# Altium schematic sheet schema.SchDoc
size A3
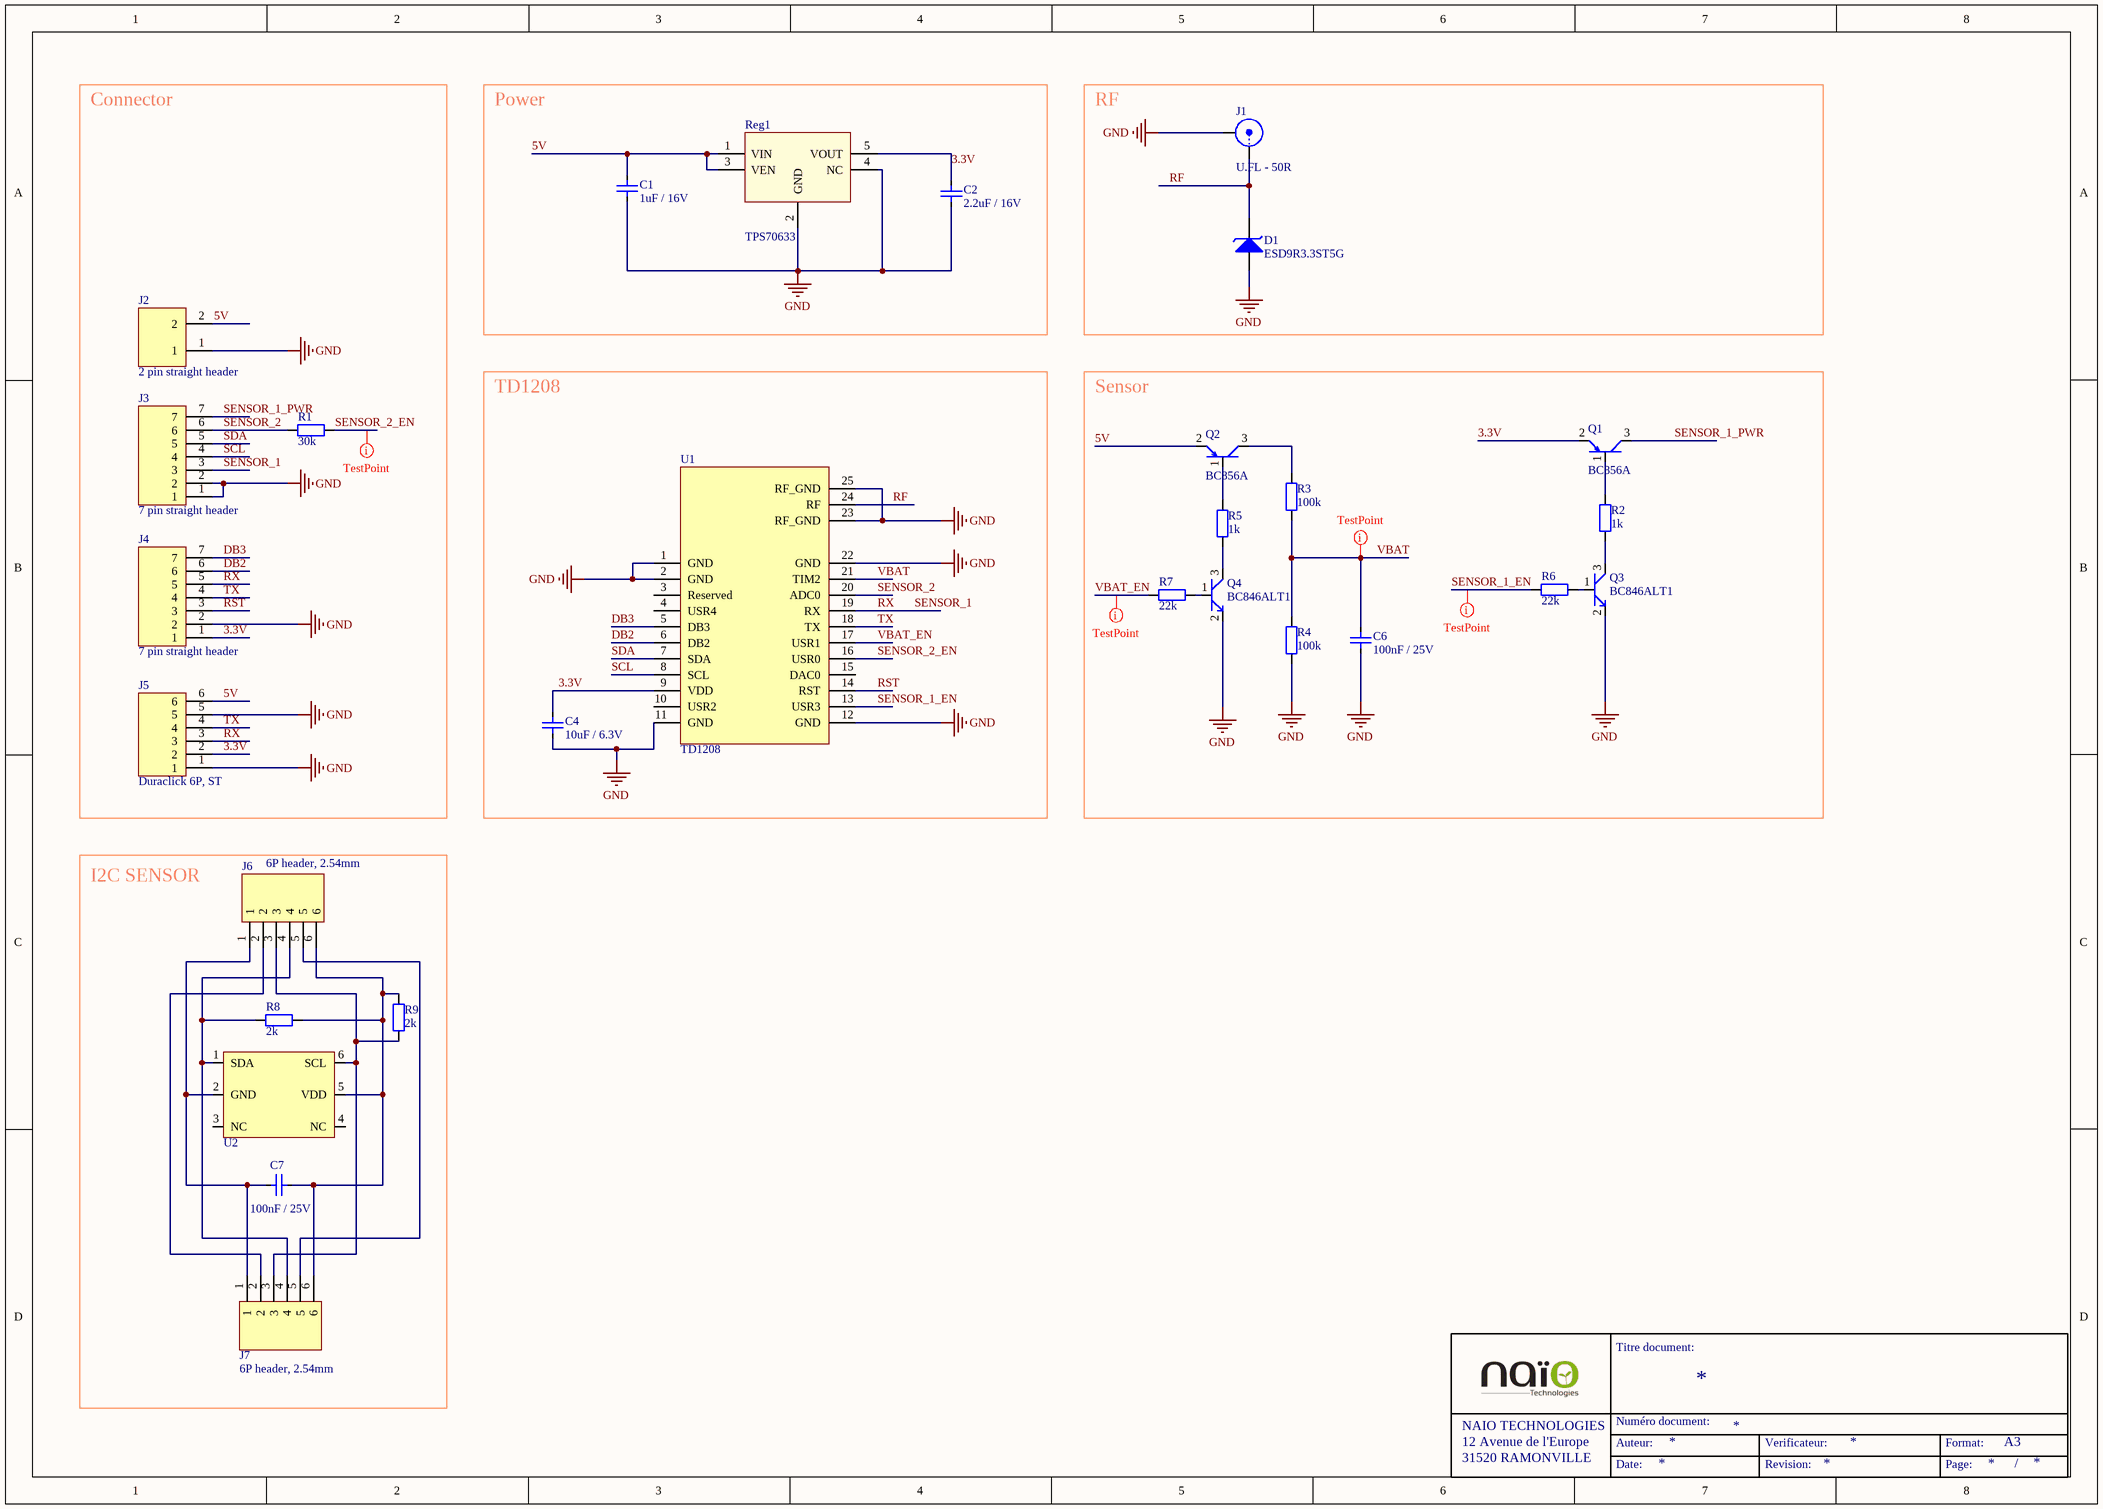
[diagram p0: schema.SchDoc]

## Parts
C1  Displayed reference: 1uF / 16V  [C0805-STD]  (hidden comment: CAP-SMD)
C2  Displayed reference: 2.2uF / 16V  [C0805-STD]  (hidden comment: CAP-SMD)
C4  Displayed reference: 10uF / 6.3V  [C0805-STD]  (hidden comment: CAP-SMD)
C6  Displayed reference: 100nF / 25V  [C0603-STD]  (hidden comment: CAP-SMD)
C7  Displayed reference: 100nF / 25V  [C0603-STD]  (hidden comment: CAP-SMD)
D1  Displayed reference: ESD9R3.3ST5G  [SOD923-SPE-ESD9R33ST5G]  (hidden comment: ESD9R33ST5G-SOD923)
J1  Displayed reference: U.FL - 50R  [UFL_R_SMT1-STD]  (hidden comment: COAX-RF)
J2  Displayed reference: 2 pin straight header  [CONN-STD-2_254_STRAIGHT_HEADER]  (hidden comment: CONN-STD-2P_1ROW)
J3  Displayed reference: 7 pin straight header  [CONN-STD-7_254_STRAIGHT_HEADER]  (hidden comment: CONN-STD-7P_1ROW)
J4  Displayed reference: 7 pin straight header  [CONN-STD-7_254_STRAIGHT_HEADER]  (hidden comment: CONN-STD-7P_1ROW)
J5  Displayed reference: Duraclick 6P, ST  [CONN-SPE-560020-0620_MOLEX]  (hidden comment: CONN-STD-6P_1ROW)
J6  Displayed reference: 6P header, 2.54mm  [6P_HEADER-STD_TH_1ROW]  (hidden comment: CONN-STD-6P_1ROW)
J7  Displayed reference: 6P header, 2.54mm  [6P_HEADER-STD_TH_1ROW]  (hidden comment: CONN-STD-6P_1ROW)
Q1  Displayed reference: BC856A  [SOT23-STD]  (hidden comment: BC856A-SOT23)
Q2  Displayed reference: BC856A  [SOT23-STD]  (hidden comment: BC856A-SOT23)
Q3  Displayed reference: BC846ALT1  [SOT23-STD]  (hidden comment: BC846ALT1-SOT23)
Q4  Displayed reference: BC846ALT1  [SOT23-STD]  (hidden comment: BC846ALT1-SOT23)
R1  Displayed reference: 30k  [R0805-STD]  (hidden comment: RES-SMD)
R2  Displayed reference: 1k  [R0603-STD]  (hidden comment: RES-SMD)
R3  Displayed reference: 100k  [R0805-STD]  (hidden comment: RES-SMD)
R4  Displayed reference: 100k  [R0805-STD]  (hidden comment: RES-SMD)
R5  Displayed reference: 1k  [R0603-STD]  (hidden comment: RES-SMD)
R6  Displayed reference: 22k  [R0603-STD]  (hidden comment: RES-SMD)
R7  Displayed reference: 22k  [R0603-STD]  (hidden comment: RES-SMD)
R8  Displayed reference: 2k  [R0603-STD]  (hidden comment: RES-SMD)
R9  Displayed reference: 2k  [R0603-STD]  (hidden comment: RES-SMD)
Reg1  Displayed reference: TPS70633  [SOT23_5-SPE-TPS706]  (hidden comment: TPS706-SOT23_5)
U1  Displayed reference: TD1208  [LGA25-SPE-TD1208]  (hidden comment: TD1208-LGA25)
U2  SHT21-DFN6  [DFN6-SPE-SHT21]  (value not drawn)

## Blocks framed on the sheet
Connector: J2-J5 R1
Power: C1 C2 Reg1
RF: D1 J1
TD1208: C4 U1
Sensor: C6 Q1-Q4 R2-R7
I2C SENSOR: C7 J6 J7 R8 R9 U2

## Nets
GND: C1.1 C2.1 C4.1 C6.1 D1.A J1.2(GND) J2.1 J3.1 J3.2 J4.2 J5.1 J5.5 Q3.2(In) Q4.2(In) R4.1 Reg1.2(GND) Reg1.4(NC) U1.1(GND) U1.2(GND) U1.11(GND) U1.12(GND) U1.22(GND) U1.23(RF_GND) U1.25(RF_GND)
3.3V: C2.2 C4.2 J4.1 J5.2 Q1.2(In) Reg1.5(VOUT) U1.9(VDD)
5V: C1.2 J2.2 J5.6 Q2.2(In) Reg1.1(VIN) Reg1.3(VEN)
DB2: J4.6 U1.6(DB2)
DB3: J4.7 U1.5(DB3)
RF: D1.K J1.1(Sig) U1.24(RF)
RST: J4.3 U1.14(RST)
RX: J3.3 J4.5 J5.3 U1.19(RX)  [also labelled SENSOR_1]
SCL: J3.4 U1.8(SCL)
SDA: J3.5 U1.7(SDA)
SENSOR_1_EN: R6.1 U1.13(USR3)
SENSOR_1_PWR: J3.7 Q1.3(In)
SENSOR_2: J3.6 R1.1 U1.20(ADC0)
SENSOR_2_EN: R1.2 U1.16(USR0)
TX: J4.4 J5.4 U1.18(TX)
VBAT: C6.2 R3.1 R4.2 U1.21(TIM2)
VBAT_EN: R7.1 U1.17(USR1)
NetC7_1: C7.1 J6.1 J7.1 U2.2(GND)
NetC7_2: C7.2 J6.6 J7.6 R8.2 R9.2 U2.5(VDD)
NetJ6_2: J6.2 J7.2
NetJ6_3: J6.3 J7.3 R9.1 U2.6(SCL)
NetJ6_4: J6.4 J7.4 R8.1 U2.1(SDA)
NetJ6_5: J6.5 J7.5
NetQ1_1: Q1.1(In) R2.2
NetQ2_1: Q2.1(In) R5.2
NetQ2_3: Q2.3(In) R3.2
NetQ3_1: Q3.1(In) R6.2
NetQ3_3: Q3.3(In) R2.1
NetQ4_1: Q4.1(In) R7.2
NetQ4_3: Q4.3(In) R5.1

Not connected (* = marked no-connect by the designer): U1 3(Reserved) 4(USR4) 10(USR2) 15(DAC0); U2 3(NC) 4(NC)

## Layout directives
net class Undefined: SENSOR_1_EN, SENSOR_2_EN, VBAT, VBAT_EN

## Notes on the sheet
- Titre document:
- NAIO TECHNOLOGIES
- 12 Avenue de l'Europe
- 31520 RAMONVILLE
- Auteur:
- Numéro document:
- Verificateur:
- Format:
- A3
- Date:
- Revision:
- Page:
- /

## Library data of the parts
C1 = C0805C105K4RACxx: 0805 1uF / 16V X7R ceramic capacitor; Manufacturer: Kemet; Max Voltage: 16; Tolerance: +/- 10%; Validated: N; Reference: C0805C105K4RACxx; Value: 1uF; Material: X7R; Footprint description: standard Capacitor 0805; Pin Count: 2; helpURL: http://www.farnell.com/datasheets/40863.pdf; Supplier 1: Farnell; Supplier Part Number 1: 9227792; Supplier 2: Digi-Key; Supplier Part Number 2: 399-6930-1-ND
C2 = C0805C225K4RACxx: 0805 2.2uF / 16V X7R ceramic capacitor; Manufacturer: Kemet; Max Voltage: 16; Tolerance: +/- 10%; Validated: N; Reference: C0805C225K4RACxx; Value: 2.2uF; Material: X7R; Footprint description: standard Capacitor 0805; Pin Count: 2; helpURL: http://www.farnell.com/datasheets/40863.pdf; Supplier 1: Farnell; Supplier Part Number 1: 1288262; Supplier 2: Digi-Key; Supplier Part Number 2: 399-6950-1-ND
C4 = C0805C106K9PACxx: 0805 10uF / 6.3V X5R ceramic capacitor; Manufacturer: Kemet; Max Voltage: 6.3; Tolerance: +/- 10%; Validated: N; Reference: C0805C106K9PACxx; Value: 10uF; Material: X5R; Footprint description: standard Capacitor 0805; Pin Count: 2; helpURL: http://www.farnell.com/datasheets/40863.pdf; Supplier 1: Farnell; Supplier Part Number 1: 1643357; Supplier 2: Digi-Key; Supplier Part Number 2: 399-3138-1-ND
C6 C7 = C0603C104K3RACXX: 0603 100nF /25V X7R ceramic capacitor; Manufacturer: Kemet; Max Voltage: 25; Tolerance: +/- 10%; Validated: N; Reference: C0603C104K3RACXX; Value: 100nF; Material: X7R; Footprint description: standard Capacitor 0603; Pin Count: 2; helpURL: http://www.farnell.com/datasheets/40863.pdf; Supplier 1: Farnell; Supplier Part Number 1: 1650835; Supplier 2: Digi-Key; Supplier Part Number 2: 399-6854-1-ND
D1 = ESD9R3.3ST5G: Diode TVS 3.3V in SMD package; Manufacturer: ON semi; Rated Power: 0.150W; Validated: FALSE; Reference: ESD9R3.3ST5G; component type: DIODE; Max Voltage: 3.3V; Footprint description: SOD-923; Pin Count: 2; Rev: 1; helpURL: http://www.onsemi.com/pub_link/Collateral/ESD9R3.3S-D.PDF; Supplier 1: Farnell; Supplier Part Number 1: 2101835; Supplier 2: Mouser; Supplier Part Number 2: 863-ESD9R3.3ST5G
J1 = UFL_R_SMT1: UF.L-R-SMT-1 SMD connector; Manufacturer: HRS; Frequency band: 6 GHz; Validated: False; Reference: UFL_R_SMT1; Footprint description: UFL_R_SMT1; Pin Count: 2; Rev: 3; helpURL: http://www.hirose.co.jp/cataloge_hp/ed_UFL_20141014.pdf; Supplier 1: Farnell; Supplier Part Number 1: 1688077; Supplier 2: Mouser; Supplier Part Number 2: 798-U.FL-R-SMT10
J2 = 640456-2: 2 PIN, 2.54mm pitch, 1 row, straight, male; Manufacturer: TE connectivity; Validated: False; Reference: 640456-2; Footprint description: 2 pin, 2.54 pitch; Pin Count: 2; Rev: W2; helpURL: http://www.farnell.com/cad/1930628.pdf; Supplier 1: Farnell; Supplier Part Number 1: 588570; Supplier 2: Mouser; Supplier Part Number 2: 571-6404562
J3 J4 = 640456-7: 7 PIN, 2.54mm pitch, 1 row, straight, male; Manufacturer: TE connectivity; Validated: False; Reference: 640456-7; Footprint description: 7 pin, 2.54 pitch; Pin Count: 7; Rev: W2; helpURL: http://www.farnell.com/cad/1930628.pdf; Supplier 1: Farnell; Supplier Part Number 1: 588623; Supplier 2: Mouser; Supplier Part Number 2: 571-6404567
J5 = 560020-0620: 6 pin, 2mm pitch herader, SM, ST; Manufacturer: MOLEX; Validated: False; Reference: 560020-0620; Footprint description: 6 Pin,ST, SMD, 2mm pitch; Pin Count: 6; helpURL: http://www.molex.com/pdm_docs/sd/5600200620_sd.pdf; Supplier 1: Mouser; Supplier Part Number 1: 538-560020-0620; Supplier 2: Farnell; Supplier Part Number 2: 2456921
J6 J7 = 68000-406HLF: 6P, 1 row, 2.54mm header; Manufacturer: FCI; Validated: False; Reference: 68000-406HLF; Footprint description: TH, 6 pin, 2.54mm; Pin Count: 6; Rev: DB; helpURL: http://portal.fciconnect.com/Comergent//fci/drawing/68000.pdf
Q1 Q2 = BC856A: PNP small signal transistor; Manufacturer: DIODES; Max Voltage: 80V; Max Current: 0.1A; Rated Power: 0.31W; Validated: False; Reference: BC856A; component type: PNP; Footprint description: SOT23 SMD Package; Pin Count: 3; Rev: 24-2; helpURL: http://www.diodes.com/_files/datasheets/ds11207.pdf; Supplier 1: Farnell; Supplier Part Number 1: 1773622; Supplier 2: Mouser; Supplier Part Number 2: 621-BC856A-7-F
Q3 Q4 = BC846ALT1: NPN small signal transistor; Manufacturer: ON semi; Max Voltage: 65V; Max Current: 0.1A; Rated Power: 0.225W; Validated: False; Reference: BC846ALT1; component type: NPN; Footprint description: SOT23 SMD Package; Pin Count: 3; Rev: D; helpURL: http://www.onsemi.com/pub_link/Collateral/BC846ALT1-D.PDF; Supplier 1: Farnell; Supplier Part Number 1: 1459036; Supplier 2: Mouser; Supplier Part Number 2: 863-BC846ALT1G
R1 = CRCW080530K0FKxx: 30k Ohm 0805 SMD resistor; Manufacturer: Vishay; Value: 30 000; Tolerance: 1 %; Rated Power: 0,125 W; Validated: No; Reference: CRCW080530K0FKxx; Footprint description: standard 0805 SMD; Pin Count: 2; helpURL: http://www.vishay.com/docs/20035/dcrcwe3.pdf; Supplier 1: Farnell; Supplier Part Number 1: 1469914; Supplier 2: Mouser; Supplier Part Number 2: 71-CRCW0805-30K-E3
R2 R5 = CRCW06031K00FKxx: 1k Ohm 0603 SMD resistor; Manufacturer: Vishay; Value: 1 000; Tolerance: 1 %; Rated Power: 0,1 W; Validated: No; Reference: CRCW06031K00FKxx; Footprint description: standard 0603 SMD; Pin Count: 2; helpURL: http://www.vishay.com/docs/20035/dcrcwe3.pdf; Supplier 1: Farnell; Supplier Part Number 1: 1783740; Supplier 2: Mouser; Supplier Part Number 2: 71-CRCW0603-1.0K-E3
R3 R4 = CRCW0805100KFKxx: 100k Ohm 0805 SMD resistor; Manufacturer: Vishay; Value: 100 000; Tolerance: 1 %; Rated Power: 0,125 W; Validated: No; Reference: CRCW0805100KFKxx; Footprint description: standard 0805 SMD; Pin Count: 2; helpURL: http://www.vishay.com/docs/20035/dcrcwe3.pdf; Supplier 1: Farnell; Supplier Part Number 1: 1469860; Supplier 2: Mouser; Supplier Part Number 2: 71-CRCW0805-100K-E3
R6 R7 = CRCW060322K0FKxx: 22k Ohm 0603 SMD resistor; Manufacturer: Vishay; Value: 22 000; Tolerance: 1 %; Rated Power: 0,1 W; Validated: No; Reference: CRCW060322K0FKxx; Footprint description: standard 0603 SMD; Pin Count: 2; helpURL: http://www.vishay.com/docs/20035/dcrcwe3.pdf; Supplier 1: Farnell; Supplier Part Number 1: 1469779; Supplier 2: Mouser; Supplier Part Number 2: 71-CRCW0603-22K-E3
R8 R9 = CRCW06032K00FKxx: 2k Ohm 0603 SMD resistor; Manufacturer: Vishay; Value: 2 000; Tolerance: 1 %; Rated Power: 0.1 W; Validated: No; Reference: CRCW06032K00FKxx; Footprint description: standard 0603 SMD; Pin Count: 2; helpURL: http://www.vishay.com/docs/20035/dcrcwe3.pdf; Supplier 1: Farnell; Supplier Part Number 1: 1151766; Supplier 2: Mouser; Supplier Part Number 2: 71-CRCW0603-2.0K-E3
Reg1 = TPS70633: 3.3V / 200mA LDO voltage regulator; Manufacturer: TI; Max Voltage: 6.5V; Max Current: 0.2A; Validated: False; Reference: TPS70633; Value: 3.3V; Footprint description: SOT23-5; Pin Count: 5; Rev: 03/2015; helpURL: http://www.ti.com/lit/ds/symlink/tps706.pdf; Supplier 1: Farnell; Supplier Part Number 1: 2483173; Supplier 2: Mouser; Supplier Part Number 2: 595-TPS70633DBVT
U1 = TD1208-C32: Sigfox module; Manufacturer: Telecom Design; Max Voltage: 3.3; Frequency band: 868 MHz; Gain: 14 dBm; Validated: False; Reference: TD1208-C32; Footprint description: LGA25; Pin Count: 25; Rev: 1.7; helpURL: https://github.com/Telecom-Design/Documentation_TD_RF_Module/raw/master/TD1208%20Datasheet.pdf
U2 = SHT21: I2C Humidity/Temperature sensor; Manufacturer: SENSIRION; Reference: SHT21; Max Voltage: 3.6V; Validated: False; Displayed reference: SHT21; Footprint description: DFN6; Pin Count: 6; Rev: 4; helpURL: https://www.sensirion.com/fileadmin/user_upload/customers/sensirion/Dokumente/Humidity_Sensors/Sensirion_Humidity_Sensors_SHT21_Datasheet_V4.pdf; Supplier 1: Newark; Supplier Part Number 1: 20T1172